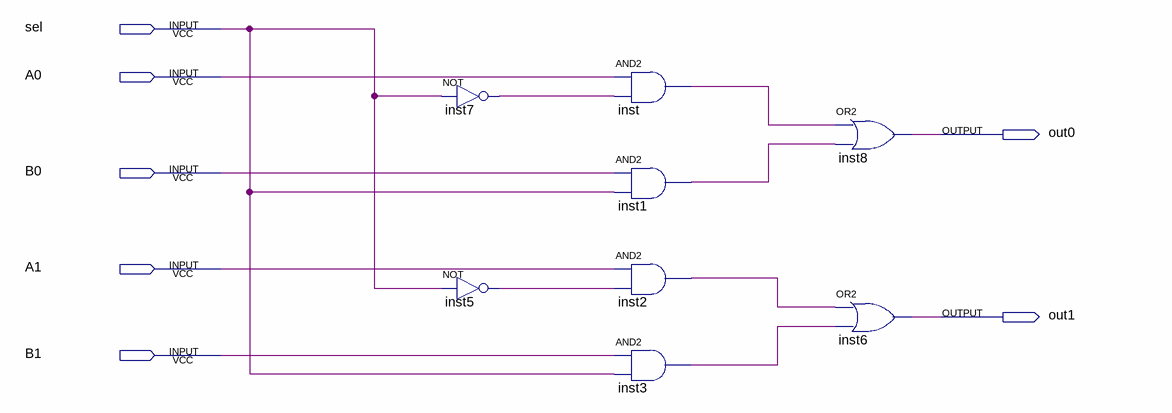
[diagram p0: schematic sheet]
// Quartus schematic mux.bdf as structural Verilog: 8 symbols, 7 pins
module mux (
  input  sel,
  input  A0,
  input  B0,
  input  A1,
  input  B1,
  output out0,
  output out1
);

  wire inst1_out, inst2_out, inst3_out, inst5_out, inst7_out, inst_out;

  not inst7 (inst7_out, sel);
  not inst5 (inst5_out, sel);
  and inst (inst_out, A0, inst7_out);
  and inst1 (inst1_out, B0, sel);
  and inst2 (inst2_out, A1, inst5_out);
  and inst3 (inst3_out, B1, sel);
  or inst8 (out0, inst_out, inst1_out);
  or inst6 (out1, inst2_out, inst3_out);
endmodule
